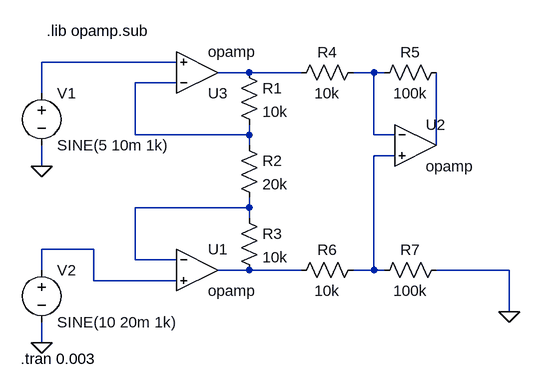
[diagram p0: schematic Instrumentaiton amplifier.asc]
Instrumentaiton amplifier.asc, the LTspice schematic file:
Version 4
SHEET 1 880 680
WIRE 144 -144 -64 -144
WIRE 256 -128 208 -128
WIRE 336 -128 256 -128
WIRE 448 -128 416 -128
WIRE 464 -128 448 -128
WIRE 144 -112 80 -112
WIRE -64 -96 -64 -144
WIRE 80 -32 80 -112
WIRE 256 -32 256 -48
WIRE 256 -32 80 -32
WIRE 448 -32 448 -128
WIRE 480 -32 448 -32
WIRE 256 -16 256 -32
WIRE 544 -16 544 -128
WIRE 480 0 448 0
WIRE -64 16 -64 -16
WIRE 256 80 256 64
WIRE 256 80 80 80
WIRE 256 96 256 80
WIRE 16 144 -64 144
WIRE 80 160 80 80
WIRE 144 160 80 160
WIRE -64 176 -64 144
WIRE 256 176 208 176
WIRE 336 176 256 176
WIRE 448 176 448 0
WIRE 448 176 416 176
WIRE 464 176 448 176
WIRE 656 176 544 176
WIRE 16 192 16 144
WIRE 144 192 16 192
WIRE 656 240 656 176
WIRE -64 288 -64 256
FLAG -64 16 0
FLAG -64 288 0
FLAG 656 240 0
SYMBOL OpAmps\\opamp 176 112 R0
SYMATTR InstName U1
SYMBOL OpAmps\\opamp 512 -80 R0
SYMATTR InstName U2
SYMBOL OpAmps\\opamp 176 -64 M180
SYMATTR InstName U3
SYMBOL res 240 -144 R0
SYMATTR InstName R1
SYMATTR Value 10k
SYMBOL res 240 -32 R0
SYMATTR InstName R2
SYMATTR Value 20k
SYMBOL res 240 80 R0
SYMATTR InstName R3
SYMATTR Value 10k
SYMBOL res 432 -144 R90
WINDOW 0 0 56 VBottom 2
WINDOW 3 32 56 VTop 2
SYMATTR InstName R4
SYMATTR Value 10k
SYMBOL res 560 -144 R90
WINDOW 0 0 56 VBottom 2
WINDOW 3 32 56 VTop 2
SYMATTR InstName R5
SYMATTR Value 100k
SYMBOL res 432 160 R90
WINDOW 0 0 56 VBottom 2
WINDOW 3 32 56 VTop 2
SYMATTR InstName R6
SYMATTR Value 10k
SYMBOL res 560 160 R90
WINDOW 0 0 56 VBottom 2
WINDOW 3 32 56 VTop 2
SYMATTR InstName R7
SYMATTR Value 100k
SYMBOL voltage -64 -112 R0
WINDOW 123 0 0 Left 0
WINDOW 39 0 0 Left 0
SYMATTR InstName V1
SYMATTR Value SINE(5 10m 1k)
SYMBOL voltage -64 160 R0
WINDOW 123 0 0 Left 0
WINDOW 39 0 0 Left 0
SYMATTR InstName V2
SYMATTR Value SINE(10 20m 1k)
TEXT -56 -192 Left 2 !.lib opamp.sub
TEXT -96 312 Left 2 !.tran 0.003

The netlist it stands for:
* Instrumentaiton amplifier.asc
XU1 N007 N008 N009 opamp Aol=100K GBW=10Meg  ; pins invin noninvin out
XU2 N003 N006 N005 opamp Aol=100K GBW=10Meg  ; pins invin noninvin out
XU3 N004 N001 N002 opamp Aol=100K GBW=10Meg  ; pins invin noninvin out
R1 N002 N004 10k
R2 N004 N007 20k
R3 N007 N009 10k
R4 N003 N002 10k
R5 N005 N003 100k
R6 N006 N009 10k
R7 0 N006 100k
V1 N001 0 SINE(5 10m 1k)
V2 N008 0 SINE(10 20m 1k)
.lib opamp.sub
.tran 0.003
.backanno
.end